# EAGLE design eurofima (EAGLE 9.5.2)
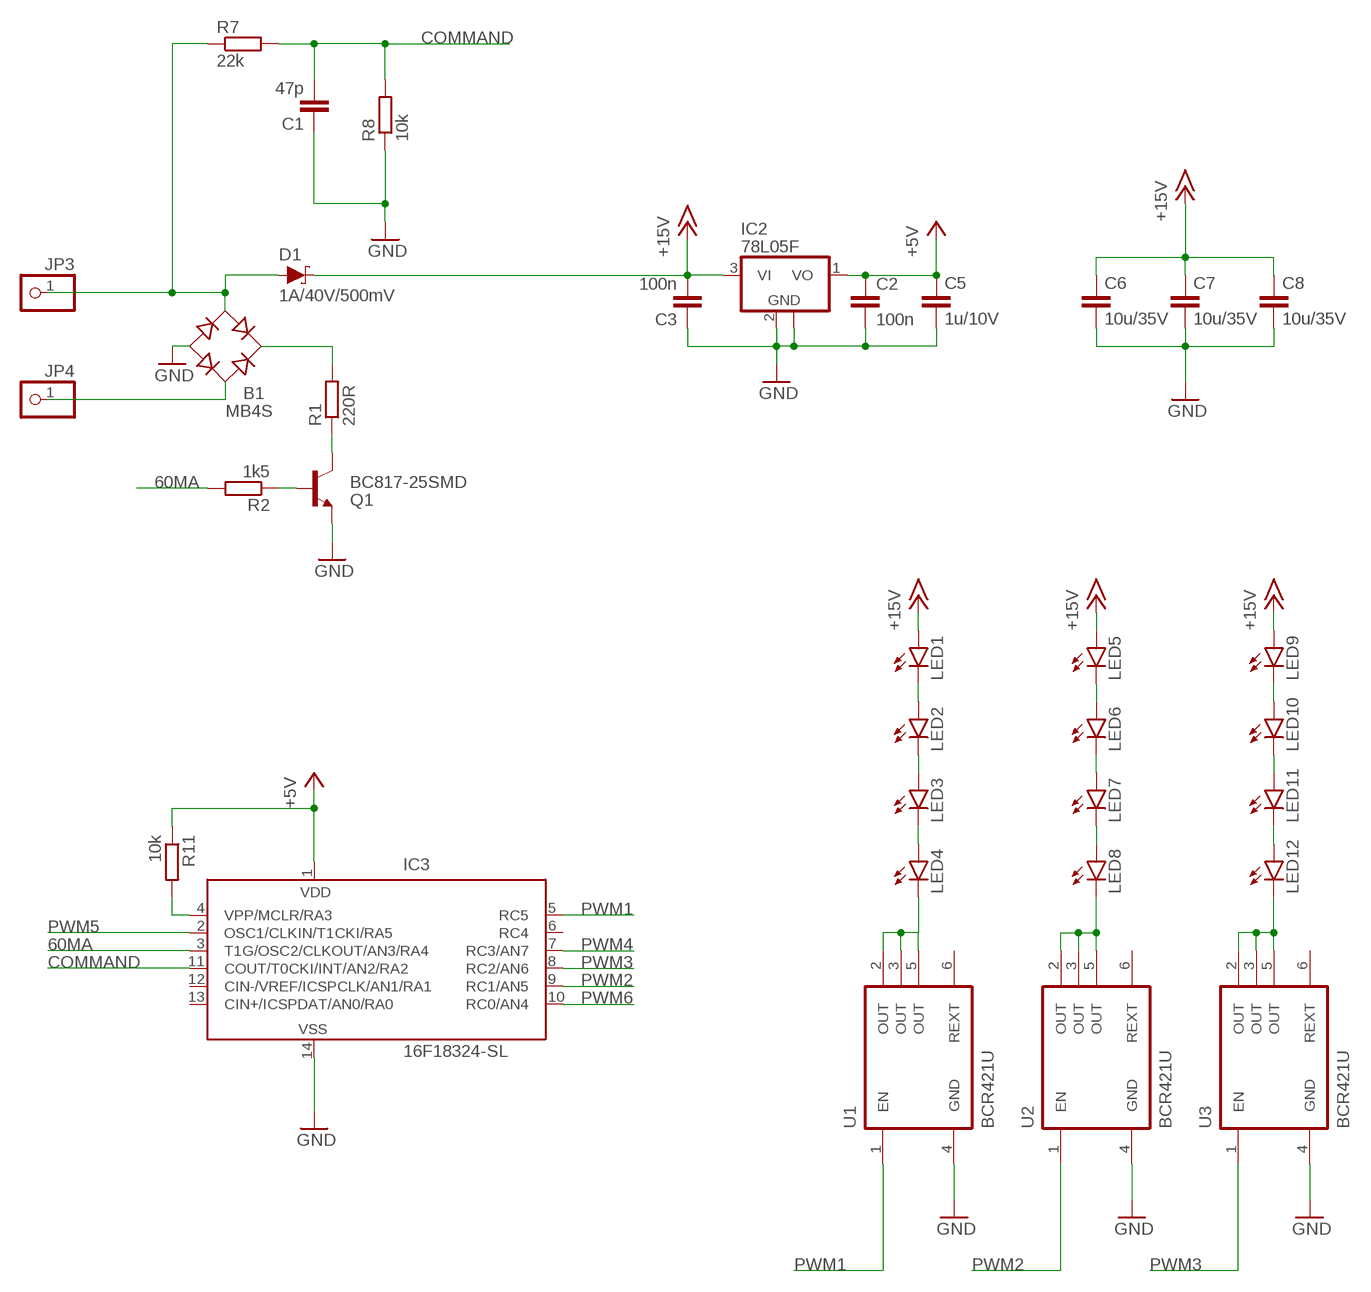
[diagram p0: schematic, sheet 1]

## Parts
B1  MB4S  [SOIC-4]
C1  47p  C-EUC0805  [C0805]
C2  100n  C-EUC3216  [C3216]
C3  100n  C-EUC3216  [C3216]
C5  1u/10V  C-EUC3216  [C3216]
C6  10u/35V  C-EUC3216  [C3216]
C7  10u/35V  C-EUC3216  [C3216]
C8  10u/35V  C-EUC3216  [C3216]
D1  1A/40V/500mV  DIODE-SCHOTTKY-SS14  [SMA-DIODE]
IC2  78L05F  [SOT89]
IC3  16F18324-SL  PIC16F676SL  [SO-14]
JP3  PINHD-1X1  [1X01]
JP4  PINHD-1X1  [1X01]
LED1  LEDKA-3528ASYC  [KA-3528ASYC]
LED2  LEDKA-3528ASYC  [KA-3528ASYC]
LED3  LEDKA-3528ASYC  [KA-3528ASYC]
LED4  LEDKA-3528ASYC  [KA-3528ASYC]
LED5  LEDKA-3528ASYC  [KA-3528ASYC]
LED6  LEDKA-3528ASYC  [KA-3528ASYC]
LED7  LEDKA-3528ASYC  [KA-3528ASYC]
LED8  LEDKA-3528ASYC  [KA-3528ASYC]
LED9  LEDKA-3528ASYC  [KA-3528ASYC]
LED10  LEDKA-3528ASYC  [KA-3528ASYC]
LED11  LEDKA-3528ASYC  [KA-3528ASYC]
LED12  LEDKA-3528ASYC  [KA-3528ASYC]
Q1  BC817-25SMD  [SOT23-BEC]
R1  220R  R-EU_R1206  [R1206]
R2  1k5  R-EU_R1206  [R1206]
R7  22k  R-EU_R1206  [R1206]
R8  10k  R-EU_R1206  [R1206]
R11  10k  R-EU_R1206  [R1206]
U1  BCR421U  [SC74-6]
U2  BCR421U  [SC74-6]
U3  BCR421U  [SC74-6]

## Nets
60MA: IC3.3(T1G/OSC2/CLKOUT/AN3/RA4) R2.2
+5V: C2.1 C5.1 IC2.1(VO) IC3.1(VDD) R11.1
+15V: C3.2 C6.1 C7.1 C8.1 D1.C IC2.3(VI) LED1.A LED5.A LED9.A
COMMAND: C1.2 IC3.11(COUT/T0CKI/INT/AN2/RA2) R7.2 R8.2
GND: B1.- C1.1 C2.2 C3.1 C5.2 C6.2 C7.2 C8.2 IC2.2(GND) IC2.2@1(GND) IC3.14(VSS) Q1.E R8.1 U1.4(GND) U2.4(GND) U3.4(GND)
N$1: B1.~2(AC2) JP4.1
N$2: B1.~1(AC1) D1.A JP3.1 R7.1
N$3: Q1.C R1.1
N$4: Q1.B R2.1
N$5: B1.+ R1.2
N$10: LED3.C LED4.A
N$11: LED7.C LED8.A
N$12: LED11.C LED12.A
N$16: LED10.C LED11.A
N$19: LED6.C LED7.A
N$20: LED2.C LED3.A
N$21: LED1.C LED2.A
N$22: LED5.C LED6.A
N$23: LED9.C LED10.A
N$28: IC3.4(VPP/MCLR/RA3) R11.2
N$30: LED4.C U1.2(OUT) U1.3(OUT) U1.5(OUT)
N$31: LED12.C U3.2(OUT) U3.3(OUT) U3.5(OUT)
N$32: LED8.C U2.2(OUT) U2.3(OUT) U2.5(OUT)
PWM1: IC3.5(RC5) U1.1(EN)
PWM2: IC3.9(RC1/AN5) U2.1(EN)
PWM3: IC3.8(RC2/AN6) U3.1(EN)
PWM4: IC3.7(RC3/AN7)
PWM5: IC3.2(OSC1/CLKIN/T1CKI/RA5)
PWM6: IC3.10(RC0/AN4)
Unconnected: IC3.6(RC4) IC3.12(CIN-/VREF/ICSPCLK/AN1/RA1) IC3.13(CIN+/ICSPDAT/AN0/RA0) U1.6(REXT) U2.6(REXT) U3.6(REXT)

## Library data of the parts
B1 = rectifier:MB*S: Bridge Rectifier Source: http://www.fairchildsemi.com/ds/MB/MB6S.pdf
C1-C3 C5-C8 = rcl:C-EU: CAPACITOR, European symbol; SPICEPREFIX: C
D1 = SparkFun-DiscreteSemi:DIODE-SCHOTTKY: Schottky diode A Schottky diode is a semiconductor diode which has a low forward voltage drop and a very fast switching action.; PROD_ID: DIO-08053
IC2 = linear:78L*: POSITOIV-VOLTAGE REGULATORS Output up to 100 mA Source: Datasheet <http://focus.ti.com/lit/ds/symlink/ua78l05.pdf>
IC3 = microchip:PIC16F676: 14-Pin, Flash-Based 8-Bit CMOS Microcontroller High Performance RISC CPU: * Only 35 instructions to learn - All single-cycle instructions except branches * Operating speed: - DC - 20 MHz oscillator/clock input - DC - 200 ns instruction cycle * Internal and external oscillator options - Precision Internal 4 MHz oscillator factory calibrated to ±1% - External Oscillator support for crystals and resonators - 5?s wake-up from SLEEP, 3.0V, typical * Power saving SLEEP mode * Wide operating voltage range - 2.0V to 5.5V * Industrial and Extended temperature range * Low power Power-on Reset (POR) * Power-up Timer (PWRT) and Oscillator Start-up Timer (OST) * Brown-out Detect (BOD) * Watchdog Timer (WDT) with independent oscillator for reliable operation * Multiplexed MCLR/Input-pin * Interrupt-on-pin change * Individual programmable weak pull-ups * Programmable code protection * High Endurance FLASH/EEPROM Cell - 100,000 write FLASH endurance - 1,000,000 write EEPROM endurance - FLASH/Data EEPROM Retention: > 40 years * Standby Current: - 1 nA @ 2.0V, typical * Operating Current: - 8.5?A @ 32 kHz, 2.0V, typical - 100?A @ 1 MHz, 2.0V, typical * Watchdog Timer Current - 300 nA @ 2.0V, typical * Timer1 oscillator current: - 4?A @ 32 kHz, 2.0V, typical * 12 I/O pins with individual direction control * High current sink/source for direct LED drive * Analog-to-Digital Converter module (PIC16F676): - 10-bit resolution - Programmable 8-channel input - Voltage reference input * In-Circuit Serial ProgrammingTM (ICSPTM) via two pins Source: http://ww1.microchip.com/downloads/en/DeviceDoc/40039E.pdf; MF: MICROCHIP; MPN: PIC16F676-I/SL; OC_FARNELL: 9760520; OC_NEWARK: 92C4557
JP3 JP4 = pinhead:PINHD-1X1: PIN HEADER
LED1-LED12 = led:LED: LED OSRAM: - CHIPLED LG R971, LG N971, LY N971, LG Q971, LY Q971, LO R971, LY R971 LH N974, LH R974 LS Q976, LO Q976, LY Q976 LO Q996 - Hyper CHIPLED LW Q18S LB Q993, LB Q99A, LB R99A - SideLED LS A670, LO A670, LY A670, LG A670, LP A670 LB A673, LV A673, LT A673, LW A673 LH A674 LY A675 LS A676, LA A676, LO A676, LY A676, LW A676 LS A679, LY A679, LG A679 - Hyper Micro SIDELED® LS Y876, LA Y876, LO Y876, LY Y876 LT Y87S - SmartLED LW L88C, LW L88S LB L89C, LB L89S, LG L890 LS L89K, LO L89K, LY L89K LS L896, LA L896, LO L896, LY L896 - TOPLED LS T670, LO T670, LY T670, LG T670, LP T670 LSG T670, LSP T670, LSY T670, LOP T670, LYG T670 LG T671, LOG T671, LSG T671 LB T673, LV T673, LT T673, LW T673 LH T674 LS T676, LA T676, LO T676, LY T676, LB T676, LH T676, LSB T676, LW T676 LB T67C, LV T67C, LT T67C, LS T67K, LO T67K, LY T67K, LW E67C LS E67B, LA E67B, LO E67B, LY E67B, LB E67C, LV E67C, LT E67C LW T67C LS T679, LY T679, LG T679 LS T770, LO T770, LY T770, LG T770, LP T770 LB T773, LV T773, LT T773, LW T773 LH T774 LS E675, LA E675, LY E675, LS T675 LS T776, LA T776, LO T776, LY T776, LB T776 LHGB T686 LT T68C, LB T68C - Hyper Mini TOPLED® LB M676 - Mini TOPLED Santana® LG M470 LS M47K, LO M47K, LY M47K Source: http://www.osram.convergy.de LUXEON: - LUMILED® LXK2-PW12-R00, LXK2-PW12-S00, LXK2-PW14-U00, LXK2-PW14-V00 LXK2-PM12-R00, LXK2-PM12-S00, LXK2-PM14-U00 LXK2-PE12-Q00, LXK2-PE12-R00, LXK2-PE12-S00, LXK2-PE14-T00, LXK2-PE14-U00 LXK2-PB12-K00, LXK2-PB12-L00, LXK2-PB12-M00, LXK2-PB14-N00, LXK2-PB14-P00, LXK2-PB14-Q00 LXK2-PR12-L00, LXK2-PR12-M00, LXK2-PR14-Q00, LXK2-PR14-R00 LXK2-PD12-Q00, LXK2-PD12-R00, LXK2-PD12-S00 LXK2-PH12-R00, LXK2-PH12-S00 LXK2-PL12-P00, LXK2-PL12-Q00, LXK2-PL12-R00 Source: www.luxeon.com KINGBRIGHT: KA-3528ASYC Source: www.kingbright.com
Q1 = transistor-npn:BC817*: NPN Transistor
R1 R2 R7 R8 R11 = rcl:R-EU_: RESISTOR, European symbol; SPICEPREFIX: R
U1-U3 = BCR421U:BCR421U: LED DRIVER; AVAILABILITY: Unavailable; DESCRIPTION: LED Driver IC 1 Output Linear PWM Dimming 350mA SOT-26; MF: Infineon; MP: BCR421U; PACKAGE: SC-74 Infineon; PRICE: None

## Board
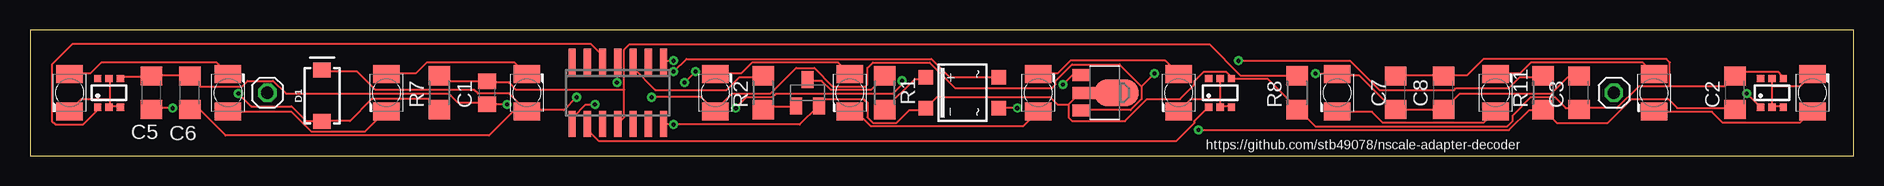
[diagram p1: board, top side]
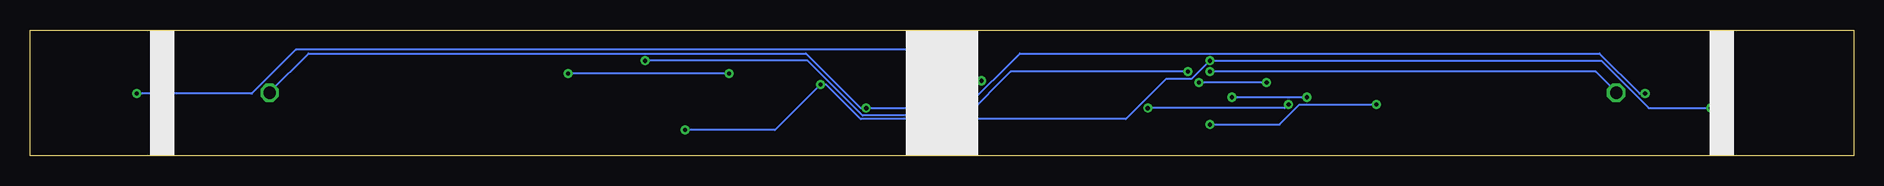
[diagram p2: board, bottom side, seen from below]

Size 152 x 10.5 mm. Coordinates in mm from the lower left corner, seen from the top.
Outline: 0,0 152,0 152,10.5 0,10.5 0,0
Copper layers (1*16): Top 0.035mm / dielectric 1.5mm / Bottom 0.035mm
Design rules "default": minimum track width 6mil, minimum drill 0.35mm, track to track 6mil, track to pad 6mil, pad to pad 6mil, via to via 6mil, smd to smd 6mil, copper to edge 40mil, drill to drill 6mil, minimum pad ring 10mil, minimum via ring 8mil, stop-mask expansion 4mil, vias tented up to drill 0mil, thermal gap 10mil

### Footprints (pad centres in the part's own frame; a part is rotated, then mirrored left to right if it is on the bottom)
SOIC-4 = smd 1.2 x 1.2: + 1.3,3.05; - -1.3,3.05; ~1 -1.3,-3.05; ~2 1.3,-3.05
C0805 = smd 1.3 x 1.5: 1 -0.95,0; 2 0.95,0
C3216 = smd 1.6 x 1.8: 1 -1.4,0; 2 1.4,0
SMA-DIODE = smd 1.27 x 1.47: A -2.15,0; C 2.15,0
SOT89 = smd 1 x 1.5: 1 -1.499,-1.981; 3 1.499,-1.981 | smd 1 x 2: 2 0,-1.727 | smd 2.2 x 3.7: 2@1 0,0.94
SO-14 = smd 0.6 x 2.2: 1 -3.81,-2.6; 2 -2.54,-2.6; 3 -1.27,-2.6; 4 0,-2.6; 5 1.27,-2.6; 6 2.54,-2.6; 7 3.81,-2.6; 8 3.81,2.6; 9 2.54,2.6; 10 1.27,2.6; 11 0,2.6; 12 -1.27,2.6; 13 -2.54,2.6; 14 -3.81,2.6
1X01 = drill 1.016 octagon: 1 0,0
KA-3528ASYC = smd 1.5 x 2.2: A -1.55,0; C 1.55,0
SOT23-BEC = smd 1 x 1.4: B -0.95,-1.1; C 0,1.1; E 0.95,-1.1
R1206 = smd 1.6 x 1.803: 1 -1.422,0; 2 1.422,0
SC74-6 = smd 0.6 x 0.6: 1 -0.95,-1.2; 2 0,-1.2; 3 0.95,-1.2; 4 0.95,1.2; 5 0,1.2; 6 -0.95,1.2

### Placement (x,y rotation side)
B1  77.72,5.25 90 top
C1  38.12,5.25 90 top
C2  142.12,5.25 90 top
C3  129.12,5.25 90 top
C5  10.12,5.25 90 top
C6  13.33,5.25 90 top
C7  113.83,5.25 90 top
C8  117.83,5.25 90 top
D1  24.34,5 90 top
IC2  89.61,5.25 270 top
IC3  49,5.25 180 top
JP3  132.02,5.25 0 top
JP4  19.78,5.25 0 top
LED1  41.42,5.25 90 top
LED2  29.72,5.25 270 top
LED3  16.51,5.25 90 top
LED4  3.3,5.25 270 top
LED5  57.13,5.25 90 top
LED6  68.33,5.25 270 top
LED7  84.04,5.25 90 top
LED8  95.75,5.25 270 top
LED9  108.95,5.25 270 top
LED10  122.16,5.25 90 top
LED11  135.37,5.25 270 top
LED12  148.57,5.25 90 top
Q1  64.81,5.25 0 top
R1  71.26,5.25 270 top
R2  61.12,5.25 90 top
R7  34.12,5.25 90 top
R8  105.62,5.25 90 top
R11  126.12,5.25 90 top
U1  6.59,5.25 0 top
U2  99.2,5.25 0 top
U3  145.2,5.25 0 top

### Tracks (layer width: path | path; a pad name or v marks a point on that pad's centre or on a via)
60MA
  Top 0.152: R2.2 61.11,6.55 59.13,6.55 58.06,5.49 52.12,5.49 50.29,7.32 50.29,7.77 IC3.3
+5V  (via drill 0.35)
  Top 0.152: C2.1 142.04,3.96 137.31,3.96 136.55,4.72 133.5,4.72 131.52,2.74 127.25,2.74 126.19,3.81 R11.1 126.03,3.81 124.97,3.81 123.29,2.13 v97.38,2.13 | v86.11,5.94 86.87,6.71 87.63,6.71 IC2.1 | v53.65,7.92 52.88,7.92 IC3.1 | v11.89,3.96 10.21,3.96 C5.1
  Bottom 0.152: v11.89,3.96 17.07,3.96 21.03,7.92 v53.65,7.92 55.17,6.4 57.3,6.4 60.66,3.05 82.75,3.05 85.65,5.94 v86.11,5.94 89.92,2.13 v97.38,2.13
+15V  (via drill 0.35)
  Top 0.152: 40.84,4.27 41.3,3.81 LED1.A | 40.84,4.27 39.93,5.18 37.34,5.18 37.03,5.49 28.8,5.49 27.28,7.01 24.38,7.01 D1.C | 40.84,4.27 38.25,1.68 16.31,1.68 14.17,3.81 13.41,3.81 C6.1 | 40.84,4.27 LED1.A | C3.2 129.08,6.55 128.17,6.55 126.8,5.18 119.18,5.18 117.96,3.96 C8.1 117.81,3.81 113.84,3.81 C7.1 113.69,3.81 110.8,6.71 108.97,6.71 LED9.A 108.81,6.86 v107.14,6.86 | 92.66,5.79 92.66,4.72 91.75,3.81 87.78,3.81 IC2.3 | 92.66,5.79 90.83,7.62 86.87,7.62 85.5,6.25 85.5,5.94 85.19,5.64 77.11,5.64 74.98,7.77 70.26,7.77 69.8,7.32 69.8,5.94 69.65,5.79 66.9,5.79 65.38,7.32 63.86,7.32 61.72,5.18 58.52,5.18 57.15,3.81 LED5.A 57,3.81 55.93,4.88 v51.82,4.88 | 92.66,5.79 v93.73,6.86 | v45.57,4.88 44.5,3.81 41.45,3.81 LED1.A
  Bottom 0.152: v93.73,6.86 v107.14,6.86 | v51.82,4.88 v45.57,4.88
COMMAND
  Top 0.152: R7.2 34.14,6.55 34.44,6.25 38.1,6.25 C1.2 38.25,6.1 39.93,6.1 40.54,5.49 49.53,5.49 | 49.53,5.49 49.53,3.2 49.07,2.74 IC3.11 | 49.53,5.49 49.53,8.84 49.99,9.3 98.3,9.3 100.89,6.71 105.61,6.71 R8.2
GND  (via drill 0.35)
  Top 0.152: C7.2 113.84,6.71 117.81,6.71 C8.2 117.96,6.71 119.79,6.71 121.16,8.08 136.4,8.08 136.7,7.77 136.7,5.79 | U3.4 146,6.55 146,6.71 145.69,7.01 142.49,7.01 142.19,6.71 C2.2 142.04,6.55 141.28,5.79 136.7,5.79 | 136.7,5.79 134.11,5.79 132.28,3.96 129.24,3.96 C3.1 129.08,3.96 128.02,3.96 127.1,4.88 125.12,4.88 123.6,3.35 123.6,2.9 123.14,2.44 107.14,2.44 105.77,3.81 R8.1 105.61,3.96 103.17,6.4 100.28,6.4 U2.4 100.13,6.55 99.67,7.01 97.84,7.01 97.08,6.25 97.08,5.94 95.86,4.72 93.12,4.72 91.29,2.9 86.87,2.9 86.56,3.2 86.56,4.27 | U1.4 7.62,6.55 10.06,6.55 C5.2 10.21,6.71 13.26,6.71 C6.2 13.41,6.55 14.17,5.79 17.68,5.79 18.14,6.25 20.27,6.25 21.34,5.18 34.9,5.18 35.66,4.42 38.1,4.42 C1.1 38.25,4.27 v39.78,4.27 | IC2.2@1 90.53,5.33 87.94,5.33 IC2.2 87.78,5.18 87.48,5.18 86.56,4.27 | IC3.14 52.88,2.59 v53.65,2.59 64.16,2.59 65.68,4.12 Q1.E 65.84,4.27 66.29,4.72 69.49,4.72 69.8,4.42 69.8,3.2 70.26,2.74 72.24,2.74 73.3,3.81 74.52,3.81 B1.- 74.68,3.96 75.59,4.88 85.04,4.88 85.65,4.27 86.56,4.27
  Bottom 0.152: v39.78,4.27 46.18,4.27 47.85,2.59 v53.65,2.59
N$1  (via drill 0.35)
  Top 0.152: v53.65,7.01 54.71,8.08 75.13,8.08 76.66,6.55 80.62,6.55 B1.~2
  Bottom 0.152: v53.65,7.01 21.49,7.01 19.81,5.33 JP4.1
N$2  (via drill 0.35)
  Top 0.152: R7.1 33.98,3.96 33.22,4.72 28.5,4.72 26.67,2.9 24.38,2.9 D1.A 24.23,2.9 23.01,2.9 21.79,4.12 18.44,4.12 v17.37,5.18 | v82.3,3.96 80.77,3.96 B1.~1
  Bottom 0.152: JP3.1 131.98,5.33 128.78,8.53 87.33,8.53 82.75,3.96 v82.3,3.96 74.07,3.96 69.49,8.53 21.18,8.53 17.83,5.18 v17.37,5.18
N$3
  Top 0.152: Q1.C 64.92,6.25 65.99,6.25 66.75,5.49 70.1,5.49 71.17,6.55 R1.1
N$4
  Top 0.152: Q1.B 63.86,4.12 61.42,4.12 61.27,3.96 R2.1
N$5
  Top 0.152: B1.+ 74.52,6.4 73.76,6.4 71.32,3.96 R1.2
N$10
  Top 0.152: LED4.A 3.35,6.86 5.03,6.86 5.94,7.77 15.54,7.77 16.46,6.86 LED3.C
N$11
  Top 0.152: LED7.C 84.12,6.86 85.65,6.86 86.72,7.92 94.64,7.92 95.71,6.86 LED8.A
N$12
  Top 0.152: LED11.C 135.48,3.66 140.21,3.66 141.12,2.74 147.52,2.74 148.44,3.66 LED12.A
N$16
  Top 0.152: LED10.C 122.22,6.86 124.21,6.86 125.12,7.77 134.42,7.77 135.33,6.86 LED11.A
N$19
  Top 0.152: LED6.C 68.43,3.66 68.89,3.66 70.1,2.44 82.75,2.44 83.97,3.66 LED7.A
N$20
  Top 0.152: LED3.A 16.61,3.66 21.79,3.66 23.47,1.98 27.89,1.98 29.57,3.66 LED2.C
N$21
  Top 0.152: LED2.A 29.72,6.86 32.16,6.86 33.07,7.77 40.39,7.77 41.3,6.86 LED1.C
N$22
  Top 0.152: LED5.C 57.15,6.86 59.28,6.86 60.2,7.77 67.36,7.77 68.28,6.86 LED6.A
N$23
  Top 0.152: LED9.C 108.97,3.66 111.86,3.66 112.78,2.74 121.16,2.74 122.07,3.66 LED10.A
N$28  (via drill 0.35)
  Top 0.152: v100.74,7.92 110.03,7.92 112.47,5.49 118.72,5.49 118.87,5.64 123.29,5.64 124.21,6.55 126.03,6.55 R11.2 | v54.56,6.1 v55.47,7.01 | v48.92,6.1 48.92,7.77 IC3.4
  Bottom 0.152: v100.74,7.92 87.17,7.92 82.6,3.35 73.91,3.35 70.26,7.01 v55.47,7.01 | v48.92,6.1 v54.56,6.1
N$30
  Top 0.152: 6.71,4.12 7.47,4.12 U1.3 | 6.71,4.12 6.71,4.72 | 6.71,4.72 6.71,6.4 U1.5 | 6.71,4.12 U1.2 | 6.71,4.72 4.27,4.72 3.35,3.81 LED4.C
N$31
  Top 0.152: 145.24,4.12 146,4.12 U3.3 | 145.24,4.12 145.24,5.79 | 145.24,5.79 145.24,6.4 U3.5 | 145.24,4.12 U3.2 | 145.24,5.79 147.52,5.79 148.44,6.71 LED12.C
N$32
  Top 0.152: 99.21,4.12 100.13,4.12 U2.3 | 99.21,4.12 99.21,4.72 | 99.21,4.72 99.21,6.4 U2.5 | 99.21,4.12 U2.2 | 99.21,4.72 96.77,4.72 95.86,3.81 LED8.C
PWM1
  Top 0.152: U1.1 5.49,3.96 5.49,3.66 4.42,2.59 2.13,2.59 1.83,2.9 1.83,7.62 3.5,9.3 46.79,9.3 47.7,8.38 47.7,7.92 IC3.5
PWM2
  Top 0.152: U2.1 98.15,3.96 97.08,2.9 97.08,2.74 95.56,1.22 47.4,1.22 46.48,2.13 46.48,2.59 IC3.9
PWM3  (via drill 0.35)
  Top 0.152: v143.1,5.18 144.17,4.12 U3.1 | v72.69,6.25 72.69,5.94 71.93,5.18 62.18,5.18 61.87,4.88 59.74,4.88 v58.83,3.96 | v47.09,4.27 46.33,4.27 45.26,3.2 45.26,2.74 IC3.8
  Bottom 0.152: v143.1,5.18 133.5,5.18 129.84,8.84 75.29,8.84 v72.69,6.25 | v58.83,3.96 47.4,3.96 v47.09,4.27

### Text on the board
tNames: https://github.com/stb49078/nscale-adapter-decoder